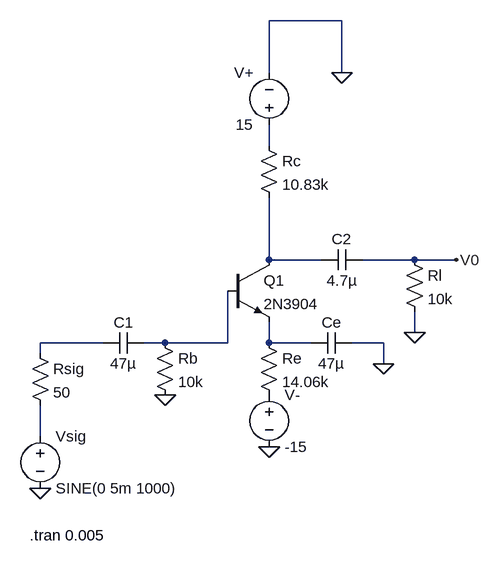
[diagram p0: schematic part1ac.asc]
part1ac.asc, the LTspice schematic file:
Version 4.1
SHEET 1 880 680
WIRE 288 -288 176 -288
WIRE 176 -208 176 -288
WIRE 288 -208 288 -288
WIRE 176 -96 176 -128
WIRE 176 80 176 -16
WIRE 256 80 176 80
WIRE 400 80 320 80
WIRE 464 80 400 80
WIRE 400 192 400 160
WIRE -80 208 -176 208
WIRE 16 208 -16 208
WIRE 112 208 112 128
WIRE 112 208 16 208
WIRE 176 208 176 176
WIRE 240 208 176 208
WIRE 352 208 304 208
WIRE -176 224 -176 208
WIRE 352 240 352 208
WIRE -176 352 -176 304
FLAG 16 288 0
FLAG 352 240 0
FLAG 400 192 0
FLAG 288 -208 0
FLAG 176 368 0
FLAG 464 80 V0
FLAG -176 432 0
SYMBOL res 0 192 R0
SYMATTR InstName Rb
SYMATTR Value 10k
SYMBOL res 160 -112 R0
SYMATTR InstName Rc
SYMATTR Value 10.83k
SYMBOL res 160 192 R0
SYMATTR InstName Re
SYMATTR Value 14.06k
SYMBOL res 384 64 R0
SYMATTR InstName Rl
SYMATTR Value 10k
SYMBOL cap -16 192 R90
WINDOW 0 0 32 VBottom 2
WINDOW 3 32 32 VTop 2
SYMATTR InstName C1
SYMATTR Value 47µ
SYMBOL cap 304 192 R90
WINDOW 0 0 32 VBottom 2
WINDOW 3 32 32 VTop 2
SYMATTR InstName Ce
SYMATTR Value 47µ
SYMBOL cap 320 64 R90
WINDOW 0 0 32 VBottom 2
WINDOW 3 32 32 VTop 2
SYMATTR InstName C2
SYMATTR Value 4.7µ
SYMBOL voltage 176 272 R0
SYMATTR InstName V-
SYMATTR Value -15
SYMBOL voltage 176 -112 R180
WINDOW 0 24 96 Left 2
WINDOW 3 24 16 Left 2
SYMATTR InstName V+
SYMATTR Value 15
SYMBOL res -192 208 R0
SYMATTR InstName Rsig
SYMATTR Value 50
SYMBOL voltage -176 336 R0
WINDOW 123 0 0 Left 0
WINDOW 39 0 0 Left 0
SYMATTR InstName Vsig
SYMATTR Value SINE(0 5m 1000)
SYMBOL npn 112 80 R0
SYMATTR InstName Q1
SYMATTR Value 2N3904
TEXT -192 504 Left 2 !.tran 0.005

The netlist it stands for:
* part1ac.asc
Rb N004 0 10k
Rc N001 N002 10.83k
Re N005 P001 14.06k
Rl V0 0 10k
C1 N004 N003 47µ
Ce 0 N005 47µ
C2 V0 N002 4.7µ
V- P001 0 -15
V+ N001 0 15
Rsig N003 N006 50
Vsig N006 0 SINE(0 5m 1000)
Q1 N002 N004 N005 0 2N3904
.model NPN NPN
.model PNP PNP
.lib standard.bjt
.tran 0.005
.backanno
.end